# EAGLE schematic dbg-prog-counter (EAGLE 9.1.3)
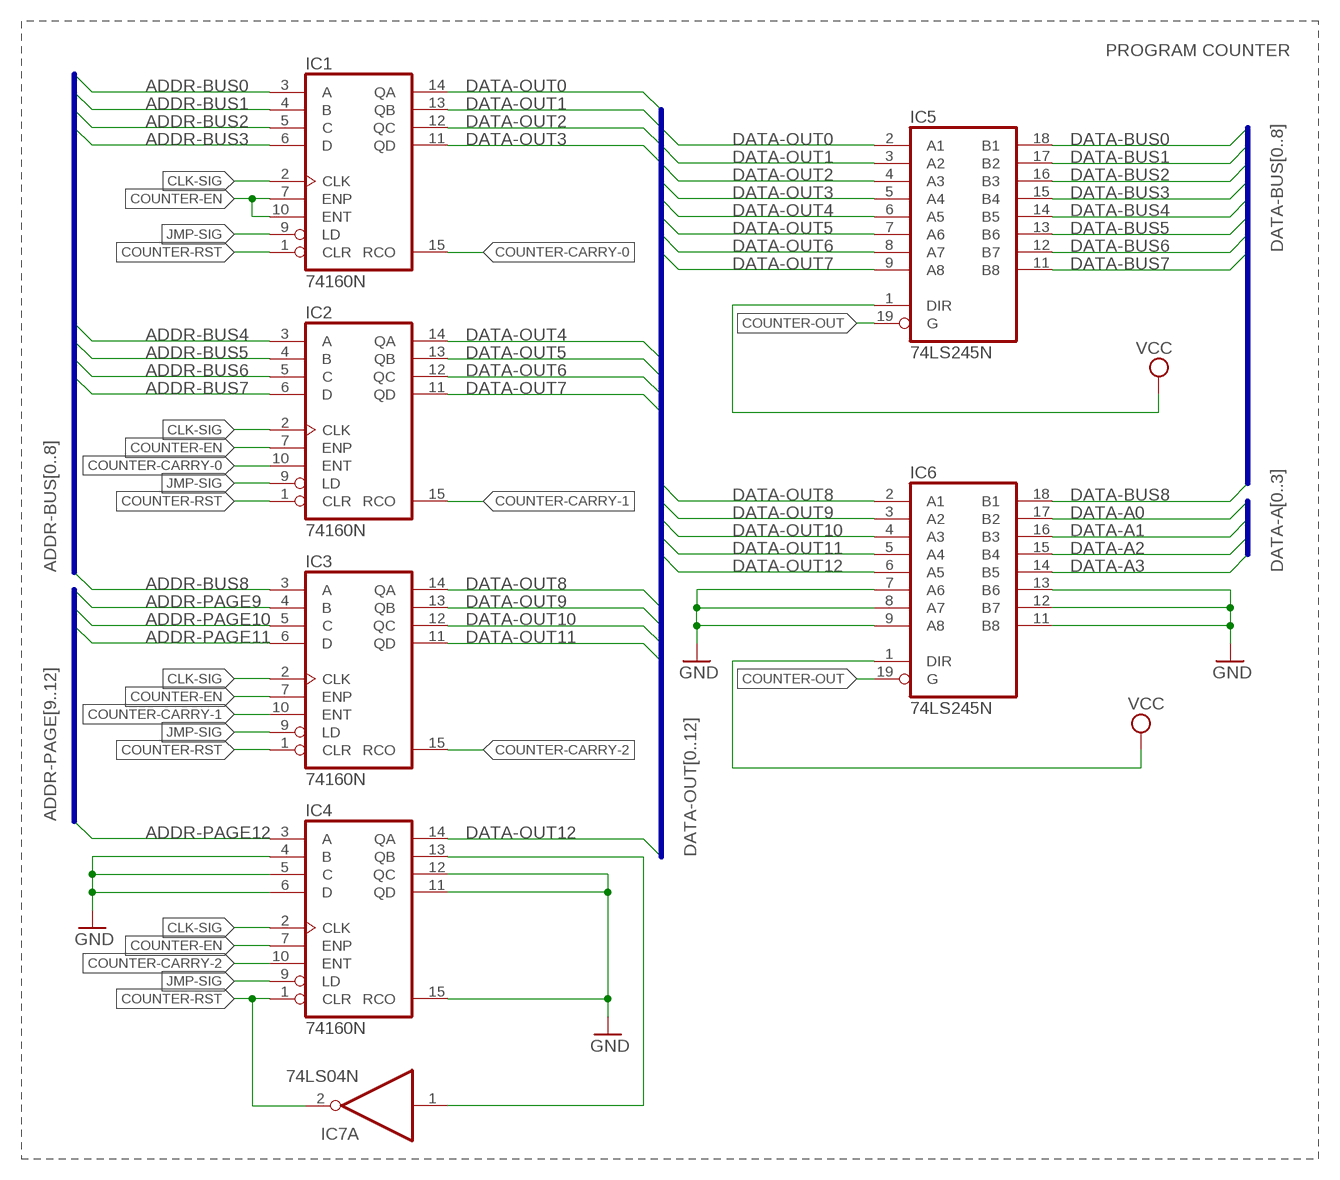
[diagram p0: schematic, sheet 1]

## Parts
IC1  74160N  [DIL16]
IC2  74160N  [DIL16]
IC3  74160N  [DIL16]
IC4  74160N  [DIL16]
IC5  74LS245N  [DIL20]
IC6  74LS245N  [DIL20]
IC7  74LS04N  [DIL14]

## Nets
ADDR-BUS0: IC1.3(A)
ADDR-BUS1: IC1.4(B)
ADDR-BUS2: IC1.5(C)
ADDR-BUS3: IC1.6(D)
ADDR-BUS4: IC2.3(A)
ADDR-BUS5: IC2.4(B)
ADDR-BUS6: IC2.5(C)
ADDR-BUS7: IC2.6(D)
ADDR-BUS8: IC3.3(A)
ADDR-PAGE9: IC3.4(B)
ADDR-PAGE10: IC3.5(C)
ADDR-PAGE11: IC3.6(D)
ADDR-PAGE12: IC4.3(A)
CLK-SIG: IC1.2(CLK) IC2.2(CLK) IC3.2(CLK) IC4.2(CLK)
COUNTER-CARRY-0: IC1.15(RCO) IC2.10(ENT)
COUNTER-CARRY-1: IC2.15(RCO) IC3.10(ENT)
COUNTER-CARRY-2: IC3.15(RCO) IC4.10(ENT)
COUNTER-EN: IC1.7(ENP) IC1.10(ENT) IC2.7(ENP) IC3.7(ENP) IC4.7(ENP)
COUNTER-OUT: IC5.19(G) IC6.19(G)
COUNTER-RST: IC1.1(CLR) IC2.1(CLR) IC3.1(CLR) IC4.1(CLR) IC7.2(A:O)
DATA-A0: IC6.17(B2)
DATA-A1: IC6.16(B3)
DATA-A2: IC6.15(B4)
DATA-A3: IC6.14(B5)
DATA-BUS0: IC5.18(B1)
DATA-BUS1: IC5.17(B2)
DATA-BUS2: IC5.16(B3)
DATA-BUS3: IC5.15(B4)
DATA-BUS4: IC5.14(B5)
DATA-BUS5: IC5.13(B6)
DATA-BUS6: IC5.12(B7)
DATA-BUS7: IC5.11(B8)
DATA-BUS8: IC6.18(B1)
DATA-OUT0: IC1.14(QA) IC5.2(A1)
DATA-OUT1: IC1.13(QB) IC5.3(A2)
DATA-OUT2: IC1.12(QC) IC5.4(A3)
DATA-OUT3: IC1.11(QD) IC5.5(A4)
DATA-OUT4: IC2.14(QA) IC5.6(A5)
DATA-OUT5: IC2.13(QB) IC5.7(A6)
DATA-OUT6: IC2.12(QC) IC5.8(A7)
DATA-OUT7: IC2.11(QD) IC5.9(A8)
DATA-OUT8: IC3.14(QA) IC6.2(A1)
DATA-OUT9: IC3.13(QB) IC6.3(A2)
DATA-OUT10: IC3.12(QC) IC6.4(A3)
DATA-OUT11: IC3.11(QD) IC6.5(A4)
DATA-OUT12: IC4.14(QA) IC6.6(A5)
GND: IC4.4(B) IC4.5(C) IC4.6(D) IC4.11(QD) IC4.12(QC) IC4.15(RCO) IC6.7(A6) IC6.8(A7) IC6.9(A8) IC6.11(B8) IC6.12(B7) IC6.13(B6)
JMP-SIG: IC1.9(LD) IC2.9(LD) IC3.9(LD) IC4.9(LD)
N$1: IC4.13(QB) IC7.1(A:I)
VCC: IC5.1(DIR) IC6.1(DIR)
Unconnected: IC7.3(B:I) IC7.4(B:O) IC7.5(C:I) IC7.6(C:O) IC7.8(D:O) IC7.9(D:I) IC7.10(E:O) IC7.11(E:I) IC7.12(F:O) IC7.13(F:I)

## Buses
DATA-OUT[0..12]
ADDR-BUS[0..8]
ADDR-PAGE[9..12]
DATA-BUS[0..8]
DATA-A[0..3]

## Notes on the sheet
- PROGRAM COUNTER

## Power pins joined to a net without a drawn wire
GND: IC1.8(GND) IC2.8(GND) IC3.8(GND) IC4.8(GND) IC5.10(GND) IC6.10(GND) IC7.7(P:GND)
VCC: IC1.16(VCC) IC2.16(VCC) IC3.16(VCC) IC4.16(VCC) IC5.20(VCC) IC6.20(VCC) IC7.14(P:VCC)

## Library data of the parts
IC1-IC4 = 74xx-eu:74*160: Synchronous 4-bit COUNTER
IC5 IC6 = 74xx-eu:74*245: Octal BUS TRANSCEIVER, 3-state
IC7 = 74xx-eu:74*04: Hex INVERTER